# Altium schematic sheet fpga_flash.SchDoc
size A3
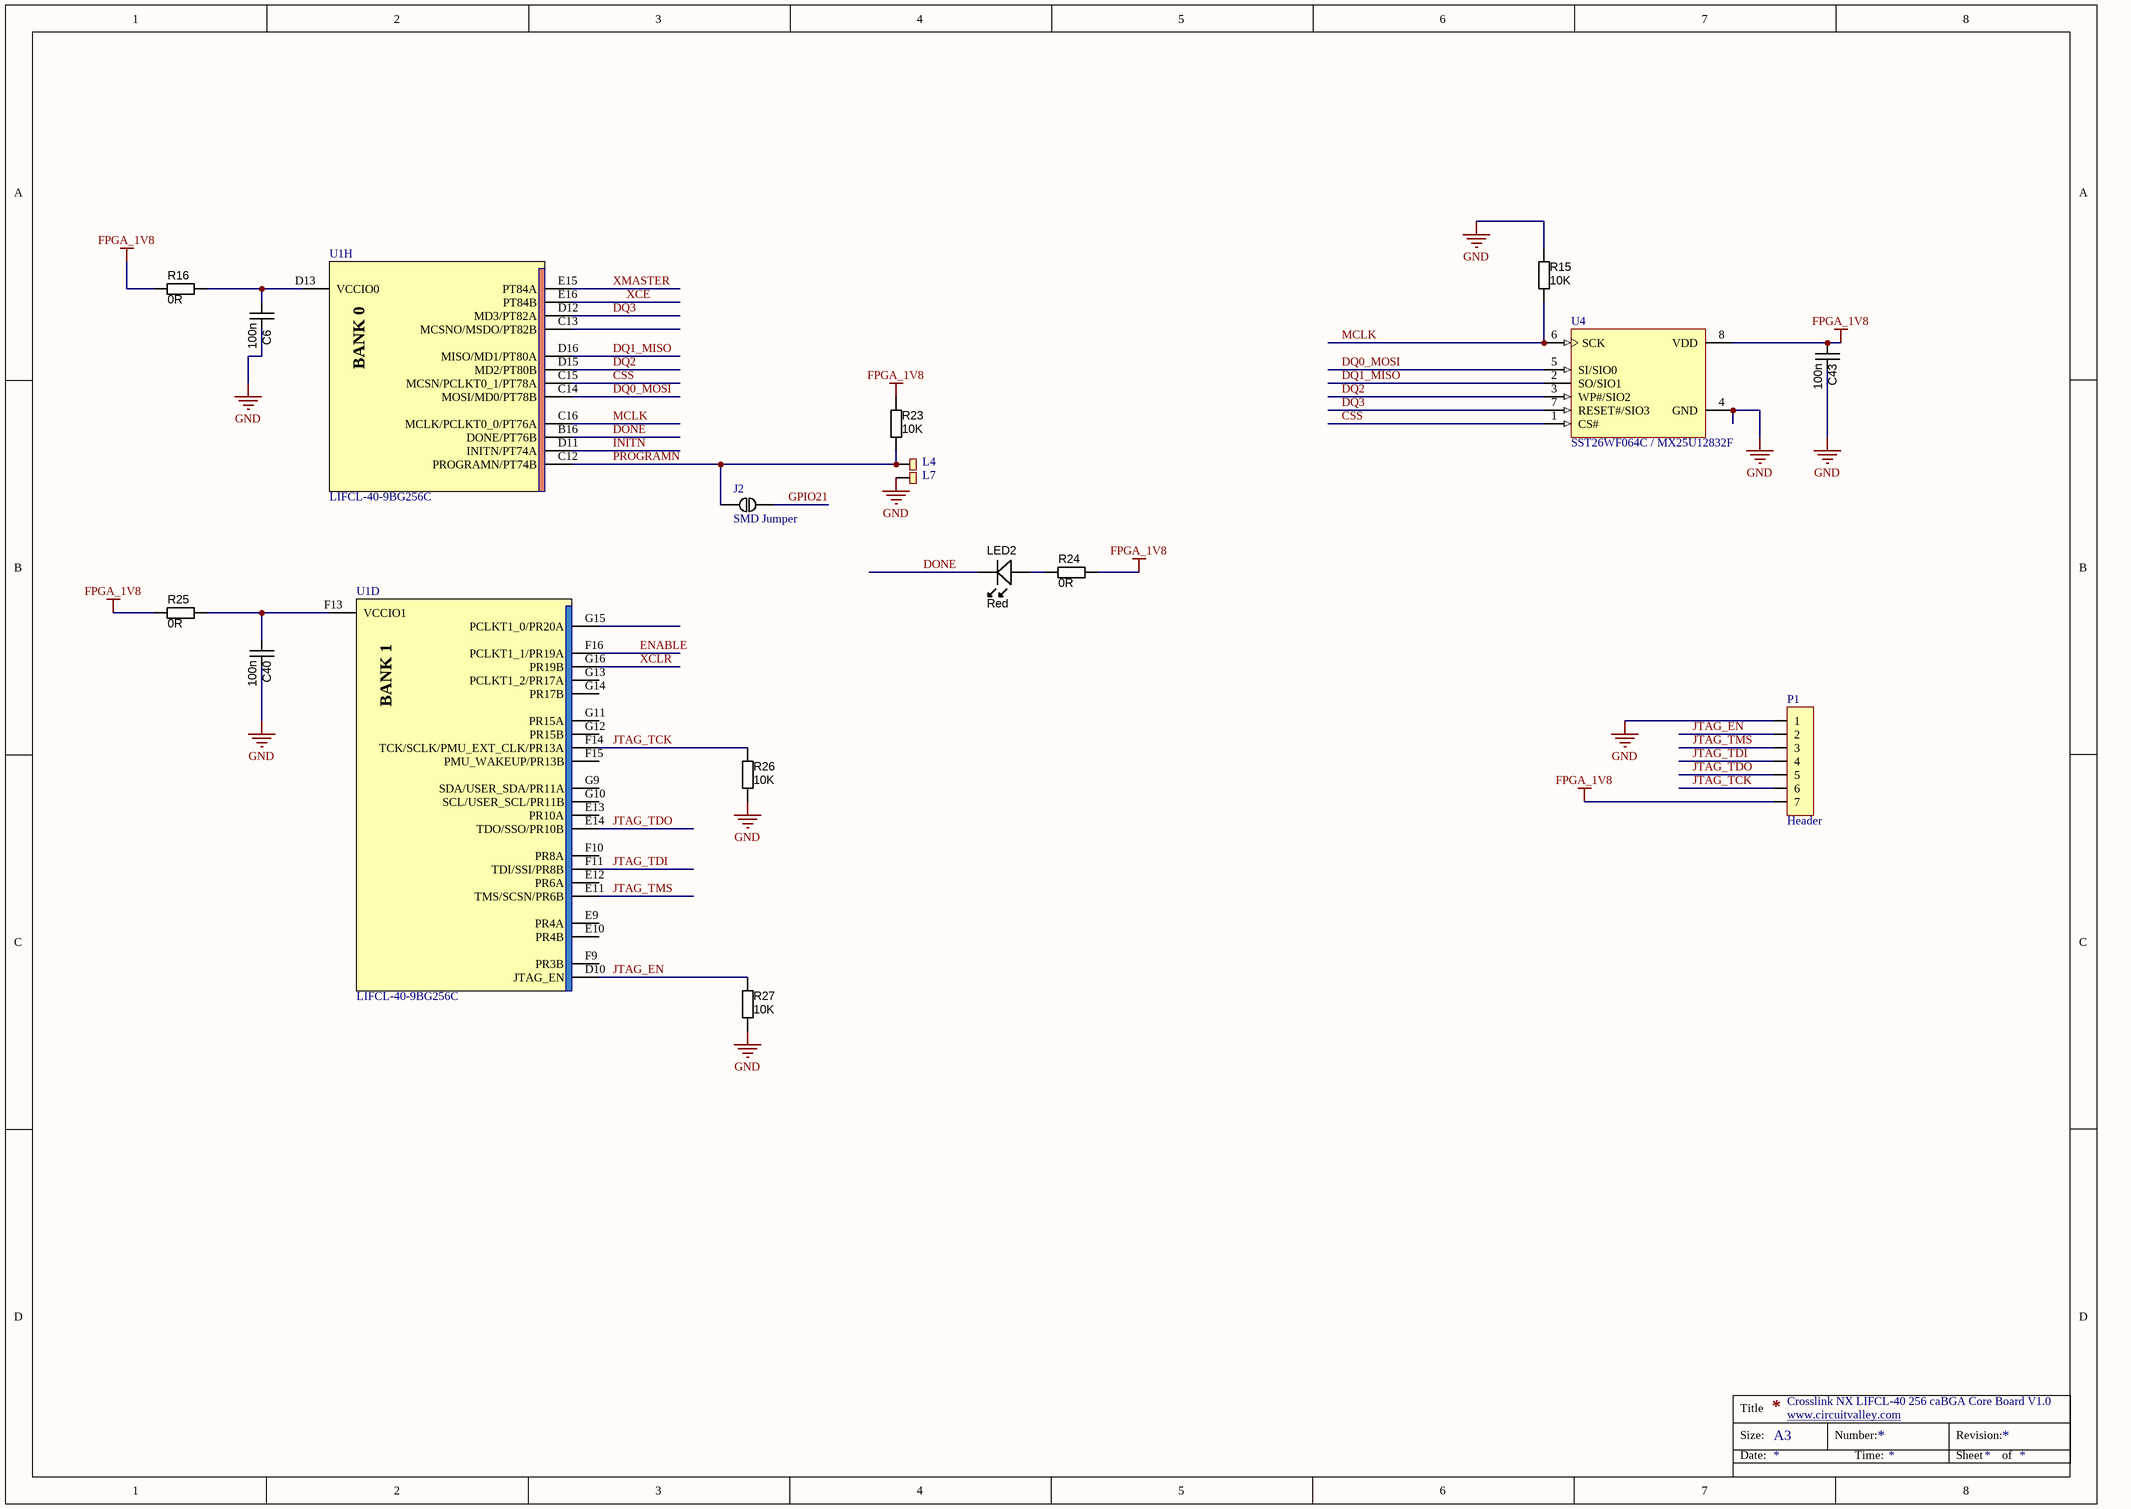
[diagram p0: fpga_flash.SchDoc]

## Parts
C6  100n  [CAPC1005N]
C40  100n  [CAPC1005N]
C43  100n  [CAPC1005N]
J2  SMD Jumper  [SMD_Jumper]
L4  TestPoint  [SMD_test_point]  (value not drawn)
L7  TestPoint  [SMD_test_point]  (value not drawn)
LED2  Red  [LED-0603-RED]
P1  Header  [SMD_Solder_points_1.27_x7]
R15  value 10K  [RESC1005N]  (hidden comment: Thick Film)
R16  value 0R  [RESC1005N]  (hidden comment: Thick Film)
R23  value 10K  [RESC1005N]  (hidden comment: Thick Film)
R24  value 0R  [RESC1005N]  (hidden comment: Thick Film)
R25  value 0R  [RESC1005N]  (hidden comment: Thick Film)
R26  value 10K  [RESC1005N]  (hidden comment: Thick Film)
R27  value 10K  [RESC1005N]  (hidden comment: Thick Film)
U1  LIFCL-40-9BG256C  [Lattice_256_CABGA]  (parts D,H of 14)
U4  SST26WF064C / MX25U12832F  [SOP8]

## Nets
FPGA_1V8: C43.2 P1.7 R16.1 R23.2 R24.1 R25.1 U4.8(VDD)
GND: C6.1 C40.1 C43.1 L7.1(TP) P1.1 R15.2 R26.1 R27.1 U4.4(GND)
CSS: U1.C15(MCSN/PCLKT0_1/PT78A) U4.1(CS#)
DONE: LED2.K U1.B16(DONE/PT76B)
DQ0_MOSI: U1.C14(MOSI/MD0/PT78B) U4.5(SI/SIO0)
DQ1_MISO: U1.D16(MISO/MD1/PT80A) U4.2(SO/SIO1)
DQ2: U1.D15(MD2/PT80B) U4.3(WP#/SIO2)
DQ3: U1.D12(MD3/PT82A) U4.7(RESET#/SIO3)
ENABLE: U1.F16(PCLKT1_1/PR19A)
GPIO21: J2.2
INITN: U1.D11(INITN/PT74A)
JTAG_EN: P1.2 R27.2 U1.D10(JTAG_EN)
JTAG_TCK: P1.6 R26.2 U1.F14(TCK/SCLK/PMU_EXT_CLK/PR13A)
JTAG_TDI: P1.4 U1.F11(TDI/SSI/PR8B)
JTAG_TDO: P1.5 U1.E14(TDO/SSO/PR10B)
JTAG_TMS: P1.3 U1.E11(TMS/SCSN/PR6B)
MCLK: R15.1 U1.C16(MCLK/PCLKT0_0/PT76A) U4.6(SCK)
PROGRAMN: J2.1 L4.1(TP) R23.1 U1.C12(PROGRAMN/PT74B)
XCE: U1.E16(PT84B)
XCLR: U1.G16(PR19B)
XMASTER: U1.E15(PT84A)
NetC6_2: C6.2 R16.2 U1.D13(VCCIO0)
NetC40_2: C40.2 R25.2 U1.F13(VCCIO1)
NetLED2_A: LED2.A R24.2

Not connected (* = marked no-connect by the designer): U1 C13(MCSNO/MSDO/PT82B) E9(PR4A) E10(PR4B) E12(PR6A) E13(PR10A) F9(PR3B) F10(PR8A) F15(PMU_WAKEUP/PR13B) G9(SDA/USER_SDA/PR11A) G10(SCL/USER_SCL/PR11B) G11(PR15A) G12(PR15B) G13(PCLKT1_2/PR17A) G14(PR17B) G15(PCLKT1_0/PR20A)

## Notes on the sheet
- Crosslink NX LIFCL-40 256 caBGA Core Board V1.0
- www.circuitvalley.com <http://www.circuitvalley.com>
- Title
- Size:
- Date:
- A3
- Number:
- Time:
- Revision:
- Sheet
- of
- (in symbol LIFCL-40-9BG256C, part D) BANK 1
- (in symbol LIFCL-40-9BG256C, part H) BANK 0

## Library data of the parts
C6 C40 C43 = CAPC_10n_0402_16V_10%: Capacitor SMD Cer 10nF 10% 16V X7R 0402; Manufacturer 1: AVX Corporation; Manufacturer Part Number 1: 0402YC103KAT2A; Ratings: 16V; X7R; Tolerance: ±10%; Operating Temperature: -55°C ~ 125°C; Package / Case: 0402 (1005 Metric); Size / Dimension: 0.039" L x 0.020" W (1.00mm x 0.50mm); Manufacturer 2: Yageo; Manufacturer Part Number 2: CC0402KRX7R7BB103; Supplier 1: Digi-Key; Supplier Part Number 1: 478-1114-1-ND; ComponentLink1URL: http://www.avx.com/docs/Catalogs/cx7r.pdf; ComponentLink1Description: http://www.avx.com/docs/Catalogs/cx7r.pdf; Supplier 2: Digi-Key; Supplier Part Number 2: 311-1042-1-ND; ComponentLink2URL: http://www.yageo.com/documents/recent/UPY-GPHC_X7R_6.3V-to-50V_8.pdf; ComponentLink2Description: http://www.yageo.com/documents/recent/UPY-GPHC_X7R_6.3V-to-50V_8.pdf; Value: 100n
J2 = SMD_Jumper
L4 L7 = SMD_Test_Point: SMD Test Point
LED2 = LED_SMD_Red_0603_220mcd: LED 0603 SMD Hyper Red 630nm 220mcd 20mA; Manufacturer 1: Kingbright Corp; Manufacturer Part Number 1: APT1608SURCK; Material: AlGaInP on GaAs; Ratings: 220 mcd; 630 nm; Voltage - Forward (Vf) Typ: 1.95V; Voltage - Forward (Vf) @ 10mA: 1.9V; Package / Case: 0603 (1608 metric); Supplier 1: Digi-Key; Supplier Part Number 1: 754-1123-1-ND
P1 = Header_7Pin
R15 R16 R23-R27 = RES_3K3_0402_5%: Resistor SMD chip 3.3k Ohm 0.063W 5% 0402; Manufacturer 1: Yageo; Manufacturer Part Number 1: RC0402JR-073K3L; Ratings: 1/16 W; Package / Case: 0402 (1005 metric); Tolerance: ±5%; Material: Thick Film; Supplier 1: Digi-Key; Supplier Part Number 1: 311-3.3KJRCT-ND; ComponentLink1URL: http://www.yageo.com/documents/recent/PYu-RC0402_51_RoHS_L_6.pdf; ComponentLink1Description: http://www.yageo.com/documents/recent/PYu-RC0402_51_RoHS_L_6.pdf
U1 = LIFCL-40-9BG256C: FPGA CorsslinkNX  LIFCL-40-9BG256C
U4 = MX25L12833F: Flash 128Mbit for Lattice FPGA